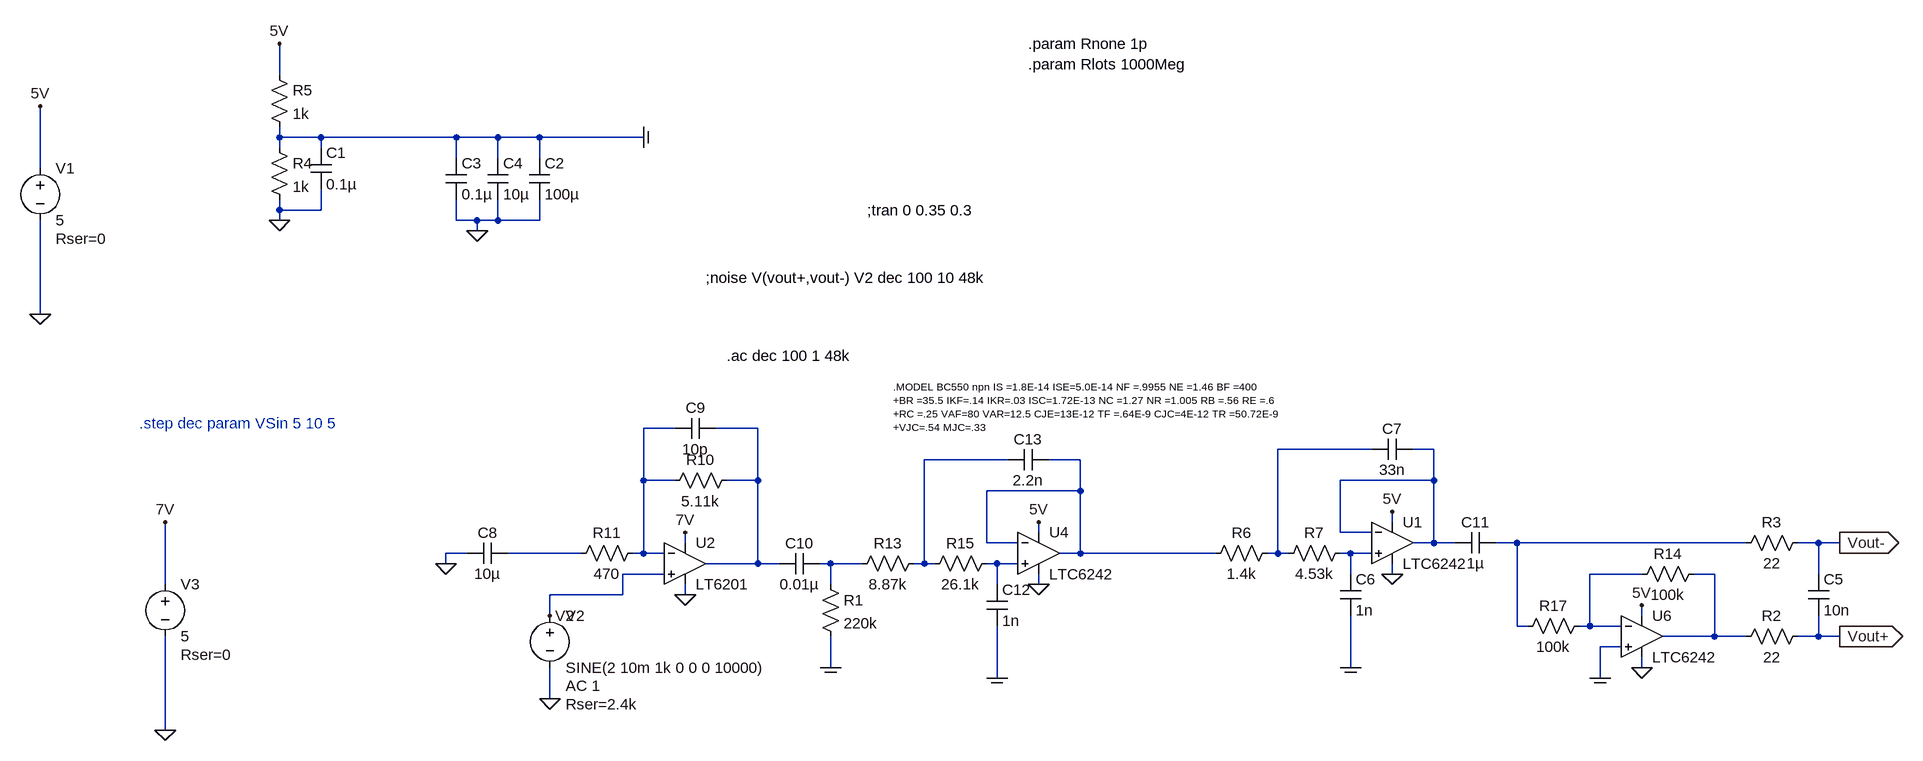
[diagram p0: schematic preampsimplified.asc]
preampsimplified.asc, the LTspice schematic file:
Version 4
SHEET 1 2944 1584
WIRE -480 -368 -480 -416
WIRE -480 -272 -480 -288
WIRE -416 -272 -480 -272
WIRE -208 -272 -416 -272
WIRE -144 -272 -208 -272
WIRE -80 -272 -144 -272
WIRE 80 -272 -80 -272
WIRE -480 -256 -480 -272
WIRE -416 -256 -416 -272
WIRE -208 -240 -208 -272
WIRE -144 -240 -144 -272
WIRE -80 -240 -80 -272
WIRE -848 -224 -848 -320
WIRE -480 -160 -480 -176
WIRE -416 -160 -416 -192
WIRE -416 -160 -480 -160
WIRE -480 -144 -480 -160
WIRE -208 -144 -208 -176
WIRE -176 -144 -208 -144
WIRE -144 -144 -144 -176
WIRE -144 -144 -176 -144
WIRE -80 -144 -80 -176
WIRE -80 -144 -144 -144
WIRE -176 -128 -176 -144
WIRE -848 0 -848 -144
WIRE 128 176 80 176
WIRE 256 176 192 176
WIRE 1200 208 1056 208
WIRE 1296 208 1264 208
WIRE 640 224 512 224
WIRE 752 224 704 224
WIRE 80 256 80 176
WIRE 128 256 80 256
WIRE 256 256 256 176
WIRE 256 256 208 256
WIRE 1296 256 1296 208
WIRE 1296 256 1152 256
WIRE 752 272 752 224
WIRE 752 272 608 272
WIRE 1232 320 1232 304
WIRE 688 336 688 320
WIRE 1152 336 1152 256
WIRE 1200 336 1152 336
WIRE 144 352 144 336
WIRE 608 352 608 272
WIRE 656 352 608 352
WIRE 1296 352 1296 256
WIRE 1296 352 1264 352
WIRE 1328 352 1296 352
WIRE 1424 352 1392 352
WIRE 1776 352 1424 352
WIRE 1888 352 1856 352
WIRE 1920 352 1888 352
WIRE -192 368 -224 368
WIRE -16 368 -128 368
WIRE 80 368 80 256
WIRE 80 368 64 368
WIRE 112 368 80 368
WIRE 752 368 752 272
WIRE 752 368 720 368
WIRE 960 368 752 368
WIRE 1056 368 1056 208
WIRE 1056 368 1040 368
WIRE 1072 368 1056 368
WIRE 1168 368 1152 368
WIRE 1200 368 1168 368
WIRE -224 384 -224 368
WIRE 256 384 256 256
WIRE 256 384 176 384
WIRE 288 384 256 384
WIRE 368 384 352 384
WIRE 416 384 368 384
WIRE 512 384 512 224
WIRE 512 384 496 384
WIRE 528 384 512 384
WIRE 624 384 608 384
WIRE 656 384 624 384
WIRE 112 400 48 400
WIRE 1168 400 1168 368
WIRE 1232 400 1232 384
WIRE 1616 400 1536 400
WIRE 1728 400 1696 400
WIRE 1888 400 1888 352
WIRE -656 416 -656 320
WIRE 368 416 368 384
WIRE 624 416 624 384
WIRE 688 416 688 400
WIRE 688 416 672 416
WIRE 48 432 48 400
WIRE 48 432 -64 432
WIRE 144 432 144 416
WIRE -64 464 -64 432
WIRE 1616 464 1616 448
WIRE 1424 480 1424 352
WIRE 1440 480 1424 480
WIRE 1536 480 1536 400
WIRE 1536 480 1520 480
WIRE 1584 480 1536 480
WIRE 1728 496 1728 400
WIRE 1728 496 1648 496
WIRE 1776 496 1728 496
WIRE 1888 496 1888 464
WIRE 1888 496 1856 496
WIRE 1920 496 1888 496
WIRE 1584 512 1552 512
WIRE 368 544 368 496
WIRE 1168 544 1168 464
WIRE 1616 544 1616 528
WIRE 624 560 624 480
WIRE 1552 560 1552 512
WIRE -64 592 -64 544
WIRE -656 640 -656 496
FLAG -64 592 0
FLAG -848 0 0
FLAG -848 -320 5V
FLAG -480 -144 0
FLAG -480 -416 5V
FLAG 80 -272 COM
FLAG -64 464 V2
FLAG -176 -128 0
FLAG 1552 560 COM
FLAG 1616 448 5V
FLAG 1616 544 0
FLAG 1920 496 Vout+
IOPIN 1920 496 Out
FLAG 1920 352 Vout-
IOPIN 1920 352 Out
FLAG 144 336 7V
FLAG 144 432 0
FLAG 1232 400 0
FLAG 1232 304 5V
FLAG 1168 544 COM
FLAG 688 416 0
FLAG 688 320 5V
FLAG 624 560 COM
FLAG -224 384 0
FLAG -656 640 0
FLAG -656 320 7V
FLAG 368 544 COM
SYMBOL voltage -848 -240 R0
WINDOW 123 0 0 Left 2
WINDOW 39 24 124 Left 2
SYMATTR SpiceLine Rser=0
SYMATTR InstName V1
SYMATTR Value 5
SYMBOL voltage -64 448 R0
WINDOW 123 24 124 Left 2
WINDOW 39 24 152 Left 2
SYMATTR Value2 AC 1
SYMATTR SpiceLine Rser=2.4k
SYMATTR InstName V2
SYMATTR Value SINE(2 10m 1k 0 0 0 10000)
SYMBOL res -496 -272 R0
SYMATTR InstName R4
SYMATTR Value 1k
SYMBOL res -496 -384 R0
SYMATTR InstName R5
SYMATTR Value 1k
SYMBOL cap -224 -240 R0
SYMATTR InstName C3
SYMATTR Value 0.1µ
SYMBOL cap -160 -240 R0
SYMATTR InstName C4
SYMATTR Value 10µ
SYMBOL res 1600 416 R270
WINDOW 0 32 56 VTop 2
WINDOW 3 0 56 VBottom 2
SYMATTR InstName R14
SYMATTR Value 100k
SYMBOL res 1424 496 R270
WINDOW 0 32 56 VTop 2
WINDOW 3 0 56 VBottom 2
SYMATTR InstName R17
SYMATTR Value 100k
SYMBOL cap -432 -256 R0
SYMATTR InstName C1
SYMATTR Value 0.1µ
SYMBOL cap -96 -240 R0
SYMATTR InstName C2
SYMATTR Value 100µ
SYMBOL res 1760 512 R270
WINDOW 0 32 56 VTop 2
WINDOW 3 0 56 VBottom 2
SYMATTR InstName R2
SYMATTR Value 22
SYMBOL res 1760 368 R270
WINDOW 0 32 56 VTop 2
WINDOW 3 0 56 VBottom 2
SYMATTR InstName R3
SYMATTR Value 22
SYMBOL cap 1872 400 R0
SYMATTR InstName C5
SYMATTR Value 10n
SYMBOL res 112 272 R270
WINDOW 0 32 56 VTop 2
WINDOW 3 0 56 VBottom 2
SYMATTR InstName R10
SYMATTR Value 5.11k
SYMBOL res -32 384 R270
WINDOW 0 32 56 VTop 2
WINDOW 3 0 56 VBottom 2
SYMATTR InstName R11
SYMATTR Value 470
SYMBOL Opamps\\LT6201 144 384 R0
SYMATTR InstName U2
SYMBOL Opamps\\LTC6242 1232 352 R0
SYMATTR InstName U1
SYMBOL Opamps\\LTC6242 1616 496 R0
SYMATTR InstName U6
SYMBOL res 1056 352 R90
WINDOW 0 0 56 VBottom 2
WINDOW 3 32 56 VTop 2
SYMATTR InstName R6
SYMATTR Value 1.4k
SYMBOL res 1168 352 R90
WINDOW 0 0 56 VBottom 2
WINDOW 3 32 56 VTop 2
SYMATTR InstName R7
SYMATTR Value 4.53k
SYMBOL cap 1152 400 R0
SYMATTR InstName C6
SYMATTR Value 1n
SYMBOL cap 1264 192 R90
WINDOW 0 0 32 VBottom 2
WINDOW 3 32 32 VTop 2
SYMATTR InstName C7
SYMATTR Value 33n
SYMBOL Opamps\\LTC6242 688 368 R0
SYMATTR InstName U4
SYMBOL res 512 368 R90
WINDOW 0 0 56 VBottom 2
WINDOW 3 32 56 VTop 2
SYMATTR InstName R13
SYMATTR Value 8.87k
SYMBOL res 624 368 R90
WINDOW 0 0 56 VBottom 2
WINDOW 3 32 56 VTop 2
SYMATTR InstName R15
SYMATTR Value 26.1k
SYMBOL cap 608 416 R0
SYMATTR InstName C12
SYMATTR Value 1n
SYMBOL cap 704 208 R90
WINDOW 0 0 32 VBottom 2
WINDOW 3 32 32 VTop 2
SYMATTR InstName C13
SYMATTR Value 2.2n
SYMBOL cap -192 384 R270
WINDOW 0 32 32 VTop 2
WINDOW 3 0 32 VBottom 2
SYMATTR InstName C8
SYMATTR Value 10µ
SYMBOL cap 192 160 R90
WINDOW 0 0 32 VBottom 2
WINDOW 3 32 32 VTop 2
SYMATTR InstName C9
SYMATTR Value 10p
SYMBOL voltage -656 400 R0
WINDOW 123 0 0 Left 2
WINDOW 39 24 124 Left 2
SYMATTR SpiceLine Rser=0
SYMATTR InstName V3
SYMATTR Value 5
SYMBOL cap 288 400 R270
WINDOW 0 32 32 VTop 2
WINDOW 3 0 32 VBottom 2
SYMATTR InstName C10
SYMATTR Value 0.01µ
SYMBOL cap 1328 368 R270
WINDOW 0 32 32 VTop 2
WINDOW 3 0 32 VBottom 2
SYMATTR InstName C11
SYMATTR Value 1µ
SYMBOL res 352 400 R0
SYMATTR InstName R1
SYMATTR Value 220k
TEXT 424 -160 Left 2 !;tran 0 0.35 0.3
TEXT 176 -56 Left 2 !;noise V(vout+,vout-) V2 dec 100 10 48k
TEXT 208 64 Left 2 !.ac dec 100 1 48k
TEXT 464 112 Left 1 !.MODEL BC550 npn IS =1.8E-14 ISE=5.0E-14 NF =.9955 NE =1.46 BF =400\n+BR =35.5 IKF=.14 IKR=.03 ISC=1.72E-13 NC =1.27 NR =1.005 RB =.56 RE =.6\n+RC =.25 VAF=80 VAR=12.5 CJE=13E-12 TF =.64E-9 CJC=4E-12 TR =50.72E-9\n+VJC=.54 MJC=.33
TEXT 672 -416 Left 2 !.param Rnone 1p
TEXT 672 -384 Left 2 !.param Rlots 1000Meg
TEXT -696 168 Left 2 ;.step dec param VSin 5 10 5

The netlist it stands for:
* preampsimplified.asc
V1 5V 0 5 Rser=0
V2 V2 0 SINE(2 10m 1k 0 0 0 10000) AC 1 Rser=2.4k
R4 COM 0 1k
R5 5V COM 1k
C3 COM 0 0.1µ
C4 COM 0 10µ
R14 N012 N013 100k
R17 N007 N012 100k
C1 COM 0 0.1µ
C2 COM 0 100µ
R2 N013 Vout+ 22
R3 N007 Vout- 22
C5 Vout- Vout+ 10n
R10 N001 N002 5.11k
R11 N008 N001 470
* U2: LT6201 (symbol Opamps\LT6201 not available, pins judged from their places): In+=V2 In-=N001 V+=7V V-=0 OUT=N002
* U1: LTC6242 (symbol Opamps\LTC6242 not available, pins judged from their places): In+=N009 In-=N004 V+=5V V-=0 OUT=N004
* U6: LTC6242 (symbol Opamps\LTC6242 not available, pins judged from their places): In+=COM In-=N012 V+=5V V-=0 OUT=N013
R6 N003 N006 1.4k
R7 N009 N003 4.53k
C6 N009 COM 1n
C7 N004 N003 33n
* U4: LTC6242 (symbol Opamps\LTC6242 not available, pins judged from their places): In+=N011 In-=N006 V+=5V V-=0 OUT=N006
R13 N005 N010 8.87k
R15 N011 N005 26.1k
C12 N011 COM 1n
C13 N006 N005 2.2n
C8 0 N008 10µ
C9 N002 N001 10p
V3 7V 0 5 Rser=0
C10 N002 N010 0.01µ
C11 N004 N007 1µ
R1 N010 COM 220k
;tran 0 0.35 0.3
;noise V(vout+,vout-) V2 dec 100 10 48k
.ac dec 100 1 48k
.MODEL BC550 npn IS =1.8E-14 ISE=5.0E-14 NF =.9955 NE =1.46 BF =400
+BR =35.5 IKF=.14 IKR=.03 ISC=1.72E-13 NC =1.27 NR =1.005 RB =.56 RE =.6
+RC =.25 VAF=80 VAR=12.5 CJE=13E-12 TF =.64E-9 CJC=4E-12 TR =50.72E-9
+VJC=.54 MJC=.33
.param Rnone 1p
.param Rlots 1000Meg
* .step dec param VSin 5 10 5
.backanno
.end